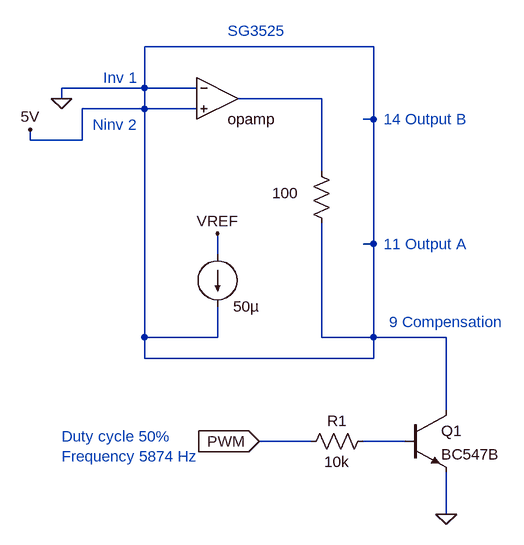
[diagram p0: schematic 05_external_pwm_signal.asc]
05_external_pwm_signal.asc, the LTspice schematic file:
Version 4
SHEET 1 2044 2052
WIRE 368 496 16 496
WIRE 16 560 16 496
WIRE 16 560 -112 560
WIRE 96 560 16 560
WIRE -112 576 -112 560
WIRE 288 576 160 576
WIRE 16 592 16 560
WIRE 16 592 -80 592
WIRE 96 592 16 592
WIRE 368 608 368 496
WIRE 368 608 352 608
WIRE -160 640 -160 624
WIRE -80 640 -80 592
WIRE -80 640 -160 640
WIRE 288 688 288 576
WIRE 368 800 368 608
WIRE 368 800 352 800
WIRE 128 816 128 784
WIRE 16 944 16 592
WIRE 128 944 128 896
WIRE 128 944 16 944
WIRE 288 944 288 768
WIRE 368 944 368 800
WIRE 368 944 288 944
WIRE 480 944 368 944
WIRE 16 976 16 944
WIRE 368 976 368 944
WIRE 368 976 16 976
WIRE 480 1056 480 944
WIRE 272 1104 192 1104
WIRE 416 1104 352 1104
WIRE 480 1216 480 1152
FLAG 128 784 VREF
FLAG -112 576 0
FLAG -160 624 5V
FLAG 480 1216 0
FLAG 192 1104 PWM
IOPIN 192 1104 In
SYMBOL current 128 816 R0
WINDOW 0 24 0 Invisible 2
SYMATTR InstName I1
SYMATTR Value 50µ
SYMBOL res 304 784 R180
WINDOW 0 36 76 Invisible 2
WINDOW 3 51 62 Left 2
SYMATTR InstName R1
SYMATTR Value 100
SYMBOL Opamps\\opamp 128 512 R0
WINDOW 0 0 32 Invisible 2
SYMATTR InstName U1
SYMBOL npn 416 1056 R0
SYMATTR InstName Q1
SYMATTR Value BC547B
SYMBOL res 368 1088 R90
WINDOW 0 0 56 VBottom 2
WINDOW 3 32 56 VTop 2
SYMATTR InstName R1
SYMATTR Value 10k
TEXT -48 544 Left 2 ;Inv 1
TEXT -64 616 Left 2 ;Ninv 2
TEXT 392 920 Left 2 ;9 Compensation
TEXT 384 800 Left 2 ;11 Output A
TEXT 384 608 Left 2 ;14 Output B
TEXT 144 472 Left 2 ;SG3525
TEXT -112 1096 Left 2 ;Duty cycle 50%\nFrequency 5874 Hz

The netlist it stands for:
* 05_external_pwm_signal.asc
I1 VREF 0 50µ
R1 0 N001 100
XU1 0 0 N001 opamp Aol=100K GBW=10Meg  ; pins invin noninvin out
Q1 0 N002 0 0 BC547B
R1 N002 PWM 10k
.model NPN NPN
.model PNP PNP
.lib standard.bjt
* Inv 1
* Ninv 2
* 9 Compensation
* 11 Output A
* 14 Output B
* SG3525
* Duty cycle 50%
* Frequency 5874 Hz
.backanno
.end